# EasyEDA Pro project CANBusTerminator.eprj

# Schematic Schematic1
Board Name: Board1; Create Date: 2026-05-23; Page Name: P1; Project Name: CANBusTerminator; Schematic Name: Schematic1; Update Date: 2026-05-23; Company: EasyEDA.com; Page Size: A4; Version: V1.0
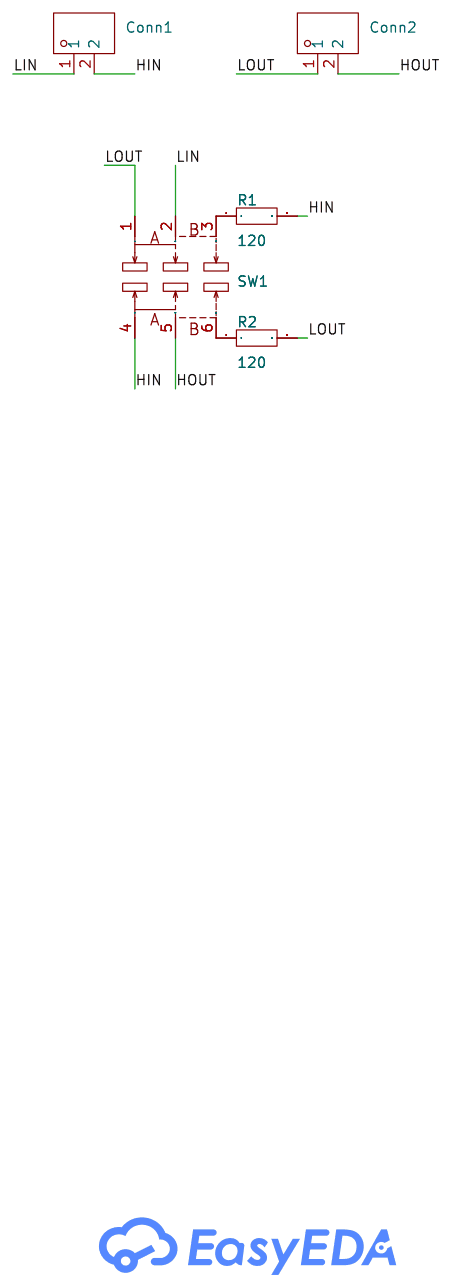
[diagram p0: schematic sheet]

## Parts
Conn1  HDGC4001SMD-S-2P  [CONN-SMD_2P-P4.00_HDGC4001SMD-S-2P]
Conn2  HDGC4001SMD-S-2P  [CONN-SMD_2P-P4.00_HDGC4001SMD-S-2P]
R1  120  [R0603]
R2  120  [R0603]
SW1  MST22D18G2 125  [SW-SMD_MST22D18G2]

## Library data of the parts
Conn1 Conn2 = HDGC4001SMD-S-2P: LCSC Part Name: 1x2P 每排P数:2 排数:1; Supplier Part: C5197184; Manufacturer: HDGC(华德共创); Supplier Footprint: SMD,P=4mm; Datasheet: https://item.szlcsc.com/datasheet/HDGC4001SMD-S-2P/5878486.html; Supplier: LCSC; Number of Positions or Pins: 1x2P; Color: Gray; Mounting Type: Surface Mount, Right Angle; Number of Pins: 2P; Number of PINs Per Row: 2; Number of Rows: 1; Current Rating: 9A; Voltage Rating (Max): 320V; Operating Temperature: -25℃~+85℃
R1 R2 = Res_0603: Supplier Footprint: 0603
SW1 = MST22D18G2 125: LCSC Part Name: MST-22D18G2脚距6.9; Supplier Part: C2906280; Manufacturer: SHOU HAN(首韩); Supplier Footprint: SMD; Datasheet: https://item.szlcsc.com/datasheet/MST22D18G2%2520125/3178990.html; Supplier: LCSC; Circuit: DPDT; Termination Style: Gull Wing; Mounting Type: Surface Mount,Vertical; Actuator Color: Black; Current Rating: 100mA; Voltage Rating: 12V; Life: 10,000 cycles; Operating Temperature: -25℃~+70℃

## Nets
HIN: Conn1.2 R1.2 SW1.4
HOUT: Conn2.2 SW1.5
LIN: Conn1.1 SW1.2
LOUT: Conn2.1 R2.2 SW1.1
$1N907: R2.1 SW1.6
$1N909: R1.1 SW1.3

# Board PCB1
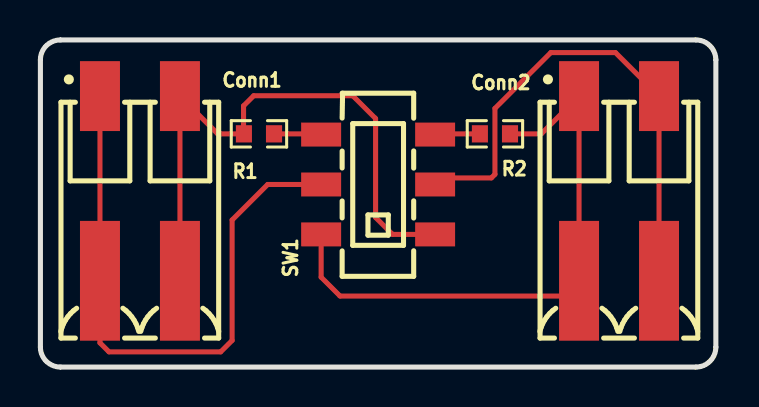
[diagram p1: board, top side]
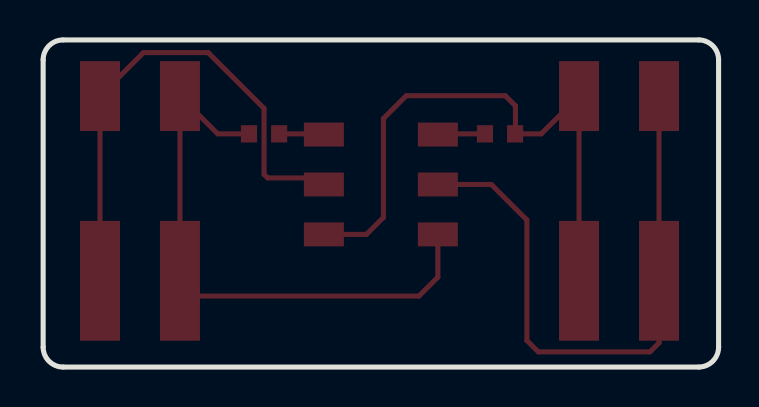
[diagram p2: board, bottom side, seen from below]

Outline 33.78 x 16.38 mm; copper layers: Top Layer, Bottom Layer. Coordinates in mm from the lower left corner of the outline.
Outline path: 0,15.38 0,1 arc(0.29,0.29) 1,0 32.78,0 arc(33.49,0.29) 33.78,1 33.78,15.38 arc(33.49,16.09) 32.78,16.38 1,16.38 arc(0.29,16.09) 0,15.38
Stack: Top Layer 0.035mm / Dielectric1 1.51mm FR4 er 4.5 / Bottom Layer 0.035mm

## Design rules (mm)
template: JLCPCB Capability(Two Layers Board)
spacing copperThickness1oz (default): track to track 0.102, other pairs 0.152 to 0.3
spacing copperThickness2oz: track to track 0.203, other pairs 0.152 to 0.3
track width copperThickness1oz (default): min 0.127, default 0.254, max 2.54
track width copperThickness2oz: min 0.203, default 0.254, max 2.54
differential pair differentialPair (default): width min 0.127, default 0.254, max 2.54; gap min 0.152, default 0.152
via viaSize (default): diameter min 0.5, default 0.61, max 10; hole min 0.3, default 0.305, max 6.3

## Placement (name value [footprint] x y rotation side)
Conn1  HDGC4001SMD-S-2P  [CONN-SMD_2P-P4.00_HDGC4001SMD-S-2P]  4.98 8.94 0 top
Conn2  HDGC4001SMD-S-2P  [CONN-SMD_2P-P4.00_HDGC4001SMD-S-2P]  28.94 8.94 0 top
R1  120  [R0603]  10.93 11.68 180 top
R2  120  [R0603]  22.73 11.68 0 top
SW1  MST22D18G2 125  [SW-SMD_MST22D18G2]  16.89 9.14 90 top

## Footprints (pads in the part's own frame, mm; a bottom-side part is the same pattern mirrored in y, then rotated)
CONN-SMD_2P-P4.00_HDGC4001SMD-S-2P
  rect 2x3.5 smd: 1(-2,4.625) 2(2,4.625)
  rect 2x6 smd: 1(-2,-4.625) 2(2,-4.625)
R0603
  rect 0.806x0.864 smd: 1(-0.753,0) 2(0.753,0)
SW-SMD_MST22D18G2
  rect 1.2x2 smd: 1(-2.5,2.85) 2(0,2.85) 3(2.5,2.85) 4(-2.5,-2.85) 5(0,-2.85) 6(2.5,-2.85)

## Nets
As in the schematic.

## Routing (per net, layer and track width the routed paths; a pad name or vN(x,y) marks a point on that pad's centre or on a via; arc(x,y) is an arc through that point)
HIN: length 30.2
  Top Layer w0.254: Conn1.2 Conn1.2 8.87,11.68 R1.2 10.16,11.7 10.16,13.08 10.67,13.59 15.62,13.59 16.76,12.45 16.76,7.49 17.61,6.64 SW1.4
HOUT: length 26
  Top Layer w0.254: Conn2.2 Conn2.2 28.76,15.75 25.53,15.75 22.73,12.95 22.73,9.65 22.55,9.47 20.07,9.47 SW1.5
LIN: length 30.6
  Top Layer w0.254: SW1.2 11.37,9.14 9.59,7.37 9.59,1.33 9.02,0.76 3.43,0.76 2.98,1.21 Conn1.1 Conn1.1
LOUT: length 29.2
  Top Layer w0.254: SW1.1 14.04,4.5 14.99,3.56 26.18,3.56 Conn2.1 Conn2.1 25.05,11.68 R2.2
$1N907: length 2.3
  Top Layer w0.254: R2.1 19.78,11.68 SW1.6
$1N909: length 2.4
  Top Layer w0.254: SW1.3 14,11.68 R1.1
